# Altium schematic sheet nrf24l01_cell.SchDoc
size A4
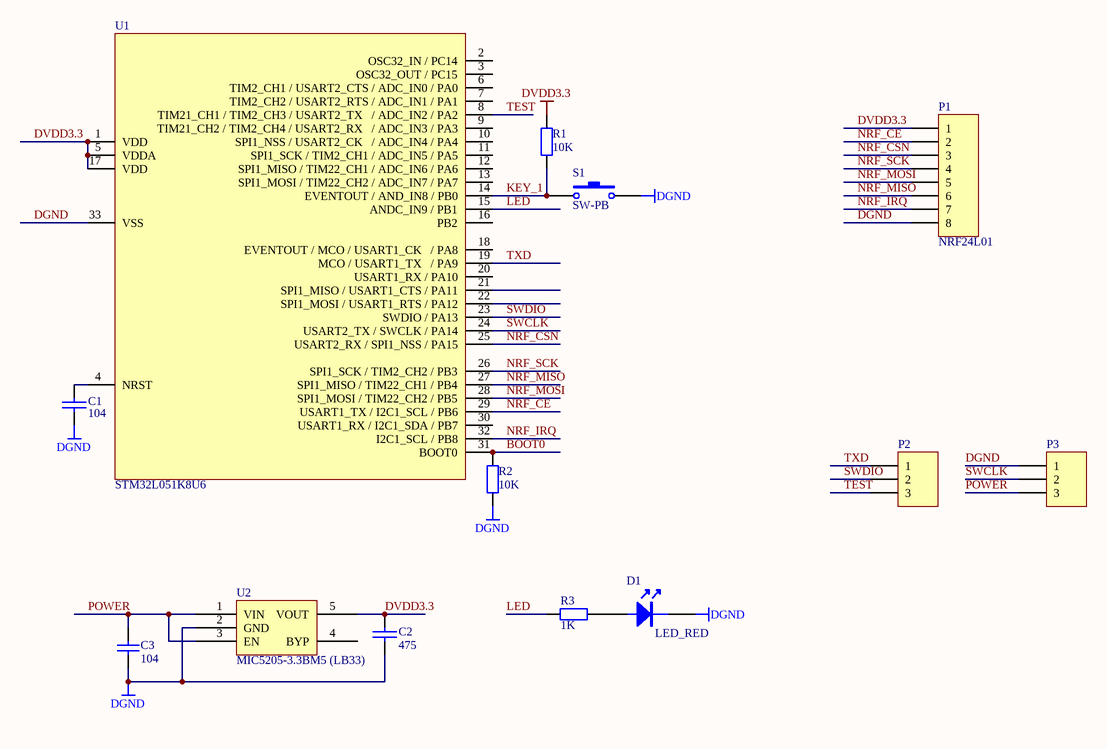
[diagram p0: nrf24l01_cell.SchDoc]

## Parts
C1  104  [1608(0603C)]
C2  475  [1608(0603C)]
C3  104  [1608(0603C)]
D1  LED_RED  [LED-0603R]
P1  NRF24L01  [SSSIP8X_N]
P2  (no value)  [SIPP3X]
P3  (no value)  [SIPP3X]
R1  10K  [1608(0603R)]
R2  10K  [1608(0603R)]
R3  1K  [1608(0603R)]
S1  SW-PB  [KEY-3]
U1  STM32L051K8U6
U2  MIC5205-3.3BM5 (LB33)  [SOT23-5]

## Nets
DGND: C1.2 C2.2 C3.1 D1.K P1.8 P3.1 R2.2 S1.1 U1.33(VSS) U2.2(GND)
DVDD3.3: C2.1 P1.1 R1.1 U1.1(VDD) U1.5(VDDA) U1.17(VDD) U2.5(VOUT)
BOOT0: R2.1 U1.31(BOOT0)
KEY_1: R1.2 S1.2 U1.14(EVENTOUT_/_AND_IN8_/_PB0)
LED: R3.1 U1.15(ANDC_IN9_/_PB1)
NRF_CE: P1.2 U1.29(USART1_TX_/_I2C1_SCL_/_PB6)
NRF_CSN: P1.3 U1.25(USART2_RX_/_SPI1_NSS_/_PA15)
NRF_IRQ: P1.7 U1.32(I2C1_SCL_/_PB8)
NRF_MISO: P1.6 U1.27(SPI1_MISO_/_TIM22_CH1_/_PB4)
NRF_MOSI: P1.5 U1.28(SPI1_MOSI_/_TIM22_CH2_/_PB5)
NRF_SCK: P1.4 U1.26(SPI1_SCK_/_TIM2_CH2_/_PB3)
POWER: C3.2 P3.3 U2.1(VIN) U2.3(EN)
SWCLK: P3.2 U1.24(USART2_TX_/_SWCLK_/_PA14)
SWDIO: P2.2 U1.23(SWDIO_/_PA13)
TEST: P2.3 U1.8(TIM21_CH1_/_TIM2_CH3_/_USART2_TX___/_ADC_IN2_/_PA2)
TXD: P2.1 U1.19(MCO_/_USART1_TX___/_PA9)
NetC1_1: C1.1 U1.4(NRST)
NetD1_A: D1.A R3.2

Not connected (* = marked no-connect by the designer): U1 2(OSC32_IN_/_PC14) 3(OSC32_OUT_/_PC15) 6(TIM2_CH1_/_USART2_CTS_/_ADC_IN0_/_PA0) 7(TIM2_CH2_/_USART2_RTS_/_ADC_IN1_/_PA1) 9(TIM21_CH2_/_TIM2_CH4_/_USART2_RX___/_ADC_IN3_/_PA3) 10(SPI1_NSS_/_USART2_CK___/_ADC_IN4_/_PA4) 11(SPI1_SCK_/_TIM2_CH1_/_ADC_IN5_/_PA5) 12(SPI1_MISO_/_TIM22_CH1_/_ADC_IN6_/_PA6) 13(SPI1_MOSI_/_TIM22_CH2_/_ADC_IN7_/_PA7) 16(PB2) 18(EVENTOUT_/_MCO_/_USART1_CK___/_PA8) 20(USART1_RX_/_PA10) 21(SPI1_MISO_/_USART1_CTS_/_PA11) 22(SPI1_MOSI_/_USART1_RTS_/_PA12) 30(USART1_RX_/_I2C1_SDA_/_PB7); U2 4(BYP)

## Library data of the parts
C1 C2 = CAP: Capacitor
C3 = Cap: Capacitor; Published: 8-Jun-2000; LatestRevisionDate: 17-Jul-2002; LatestRevisionNote: Re-released for DXP Platform.; PackageReference: RAD-0.3; Publisher: Altium Limited; Value: 104
D1 = LED
P1 = Header 8: Header, 8-Pin; LatestRevisionDate: 17-Jul-2002; LatestRevisionNote: Re-released for DXP Platform.; Publisher: Altium Limited
P2 P3 = Header 3: Header, 3-Pin; LatestRevisionDate: 17-Jul-2002; LatestRevisionNote: Re-released for DXP Platform.; Publisher: Altium Limited
R1 R2 = Res2: Resistor; Value: 1K; Published: 8-Jun-2000; LatestRevisionDate: 17-Jul-2002; LatestRevisionNote: Re-released for DXP Platform.; PackageReference: AXIAL-0.4; Publisher: Altium Limited
R3 = Res2: Resistor; Published: 8-Jun-2000; LatestRevisionDate: 17-Jul-2002; LatestRevisionNote: Re-released for DXP Platform.; PackageReference: AXIAL-0.4; Publisher: Altium Limited; Value: 1K
S1 = SW-PB: Switch; Published: 24-Mar-1999; LatestRevisionDate: 17-Jul-2002; LatestRevisionNote: Re-released for DXP Platform.; PackageReference: SPST-2; Publisher: Altium Limited
U2 = MIC5205